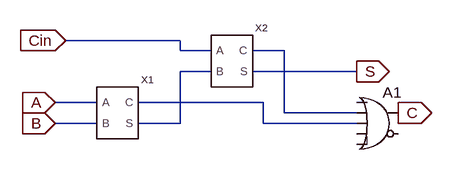
[diagram p0: schematic FullAdder.asc]
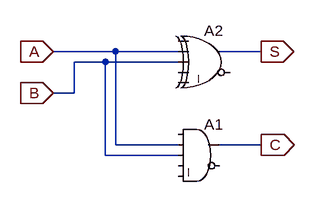
[diagram p1: sub-circuit halfadder.asc]
FullAdder.asc, the LTspice schematic file:
Version 4
SHEET 1 880 680
WIRE 240 64 64 64
WIRE 240 80 240 64
WIRE 288 80 240 80
WIRE 400 80 352 80
WIRE 288 112 240 112
WIRE 512 112 352 112
WIRE 112 160 48 160
WIRE 368 160 176 160
WIRE 400 176 400 80
WIRE 512 176 400 176
WIRE 112 192 48 192
WIRE 240 192 240 112
WIRE 240 192 176 192
WIRE 368 192 368 160
WIRE 512 192 368 192
FLAG 64 64 Cin
IOPIN 64 64 In
FLAG 48 160 A
IOPIN 48 160 In
FLAG 48 192 B
IOPIN 48 192 In
FLAG 512 112 S
IOPIN 512 112 Out
FLAG 576 176 C
IOPIN 576 176 Out
SYMBOL HalfAdder 144 176 R0
SYMATTR InstName X1
SYMBOL HalfAdder 320 96 R0
SYMATTR InstName X2
SYMBOL Digital\\or 544 128 R0
SYMATTR InstName A1

halfadder.asc, the sub-circuit schematic file:
Version 4
SHEET 1 880 680
WIRE 128 128 32 128
WIRE 224 128 128 128
WIRE 352 128 288 128
WIRE 112 144 64 144
WIRE 224 144 112 144
WIRE 64 192 64 144
WIRE 64 192 32 192
WIRE 128 272 128 128
WIRE 224 272 128 272
WIRE 352 272 288 272
WIRE 112 288 112 144
WIRE 224 288 112 288
FLAG 32 128 A
IOPIN 32 128 In
FLAG 32 192 B
IOPIN 32 192 In
FLAG 352 272 C
IOPIN 352 272 Out
FLAG 352 128 S
IOPIN 352 128 Out
SYMBOL Digital\\and 256 224 R0
SYMATTR InstName A1
SYMBOL Digital\\xor 272 80 R0
SYMATTR InstName A2

The netlist it stands for:
* FullAdder.asc
XX1 A B N003 N002 halfadder
XX2 Cin N002 N001 S halfadder
A1 0 N001 N003 0 0 0 C 0 OR

* block symbol definitions
.subckt halfadder A B C S
A1 0 A B 0 0 0 C 0 AND
A2 0 A B 0 0 0 S 0 XOR
.ends halfadder

.backanno
.end